# EasyEDA Pro project ProPrj_Dual_Motor_Driver_2026-05-02.epro, schematic Schematic1

## Sheets
1 Motor Driver IC: Board Name: Board1; Create Date: 2025-10-15; Page Name: Motor Driver IC; Project Name: Dual_Motor_Driver; Schematic Name: Schematic1; Update Date: 2025-10-17; Company: EasyEDA.com; Page Size: A4; Version: V1.0
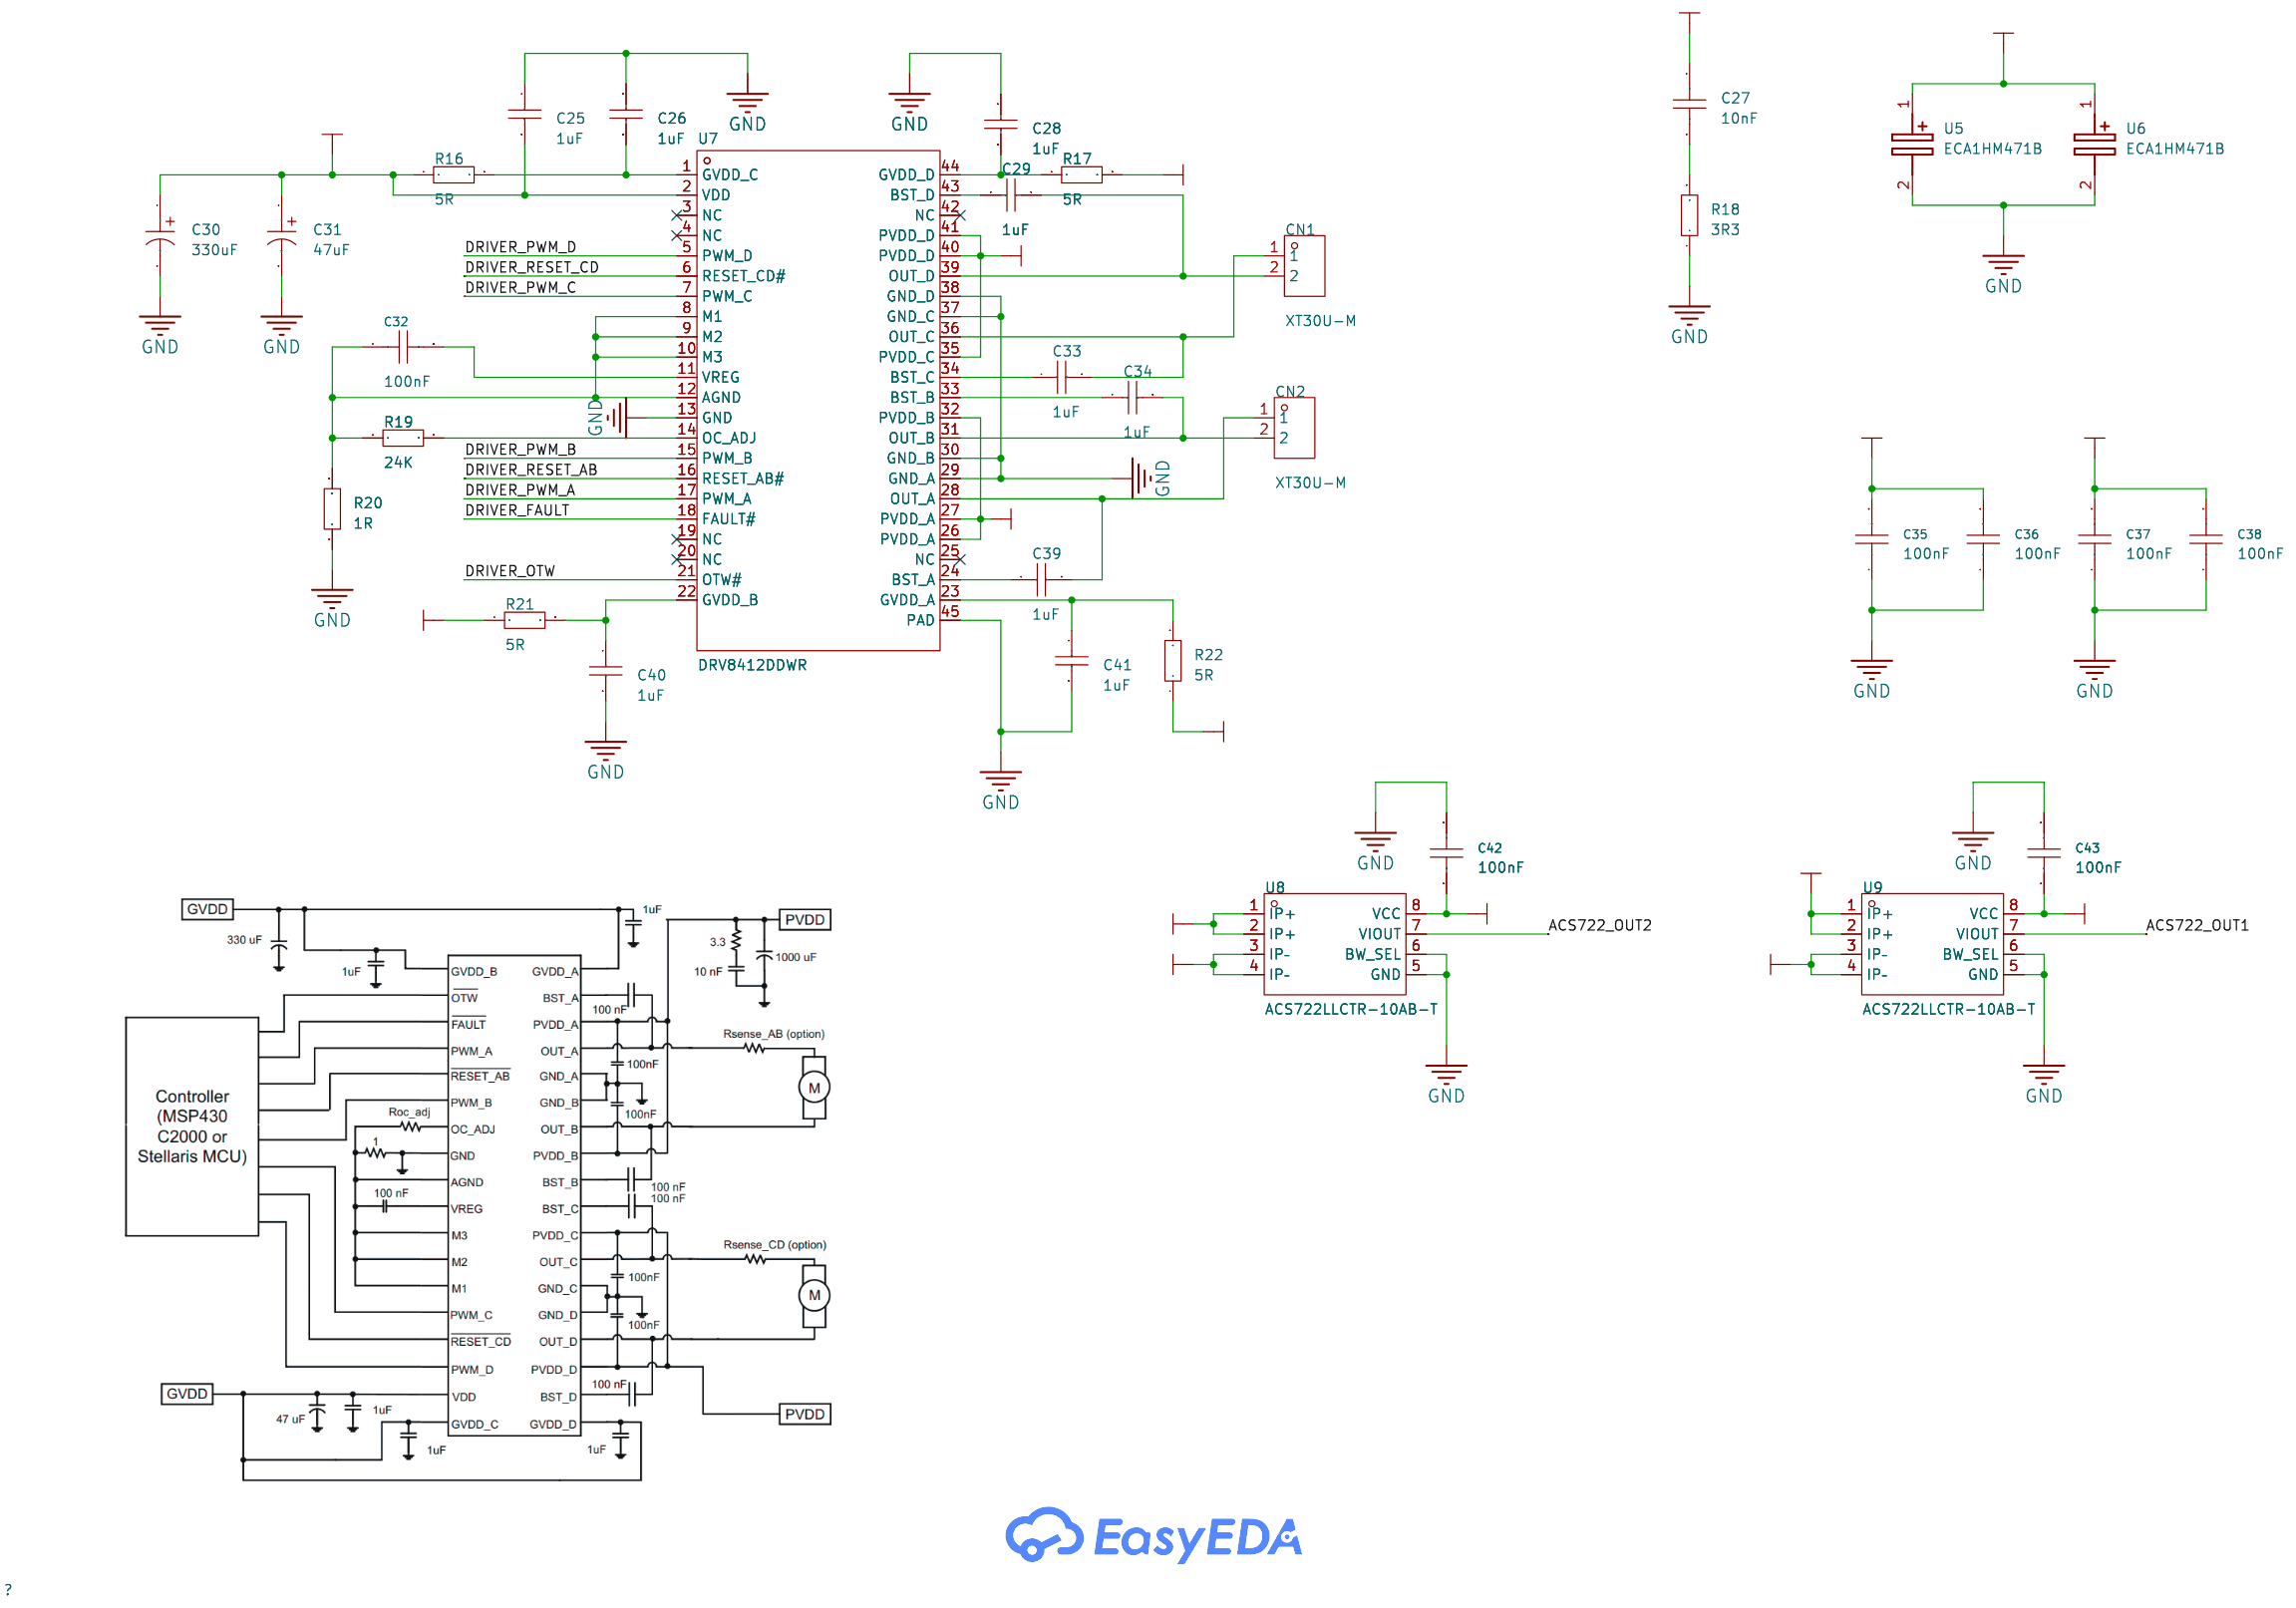
[diagram p0: Motor Driver IC]
2 Power Electroncis: Page Name: Power Electroncis; Update Date: 2025-10-18
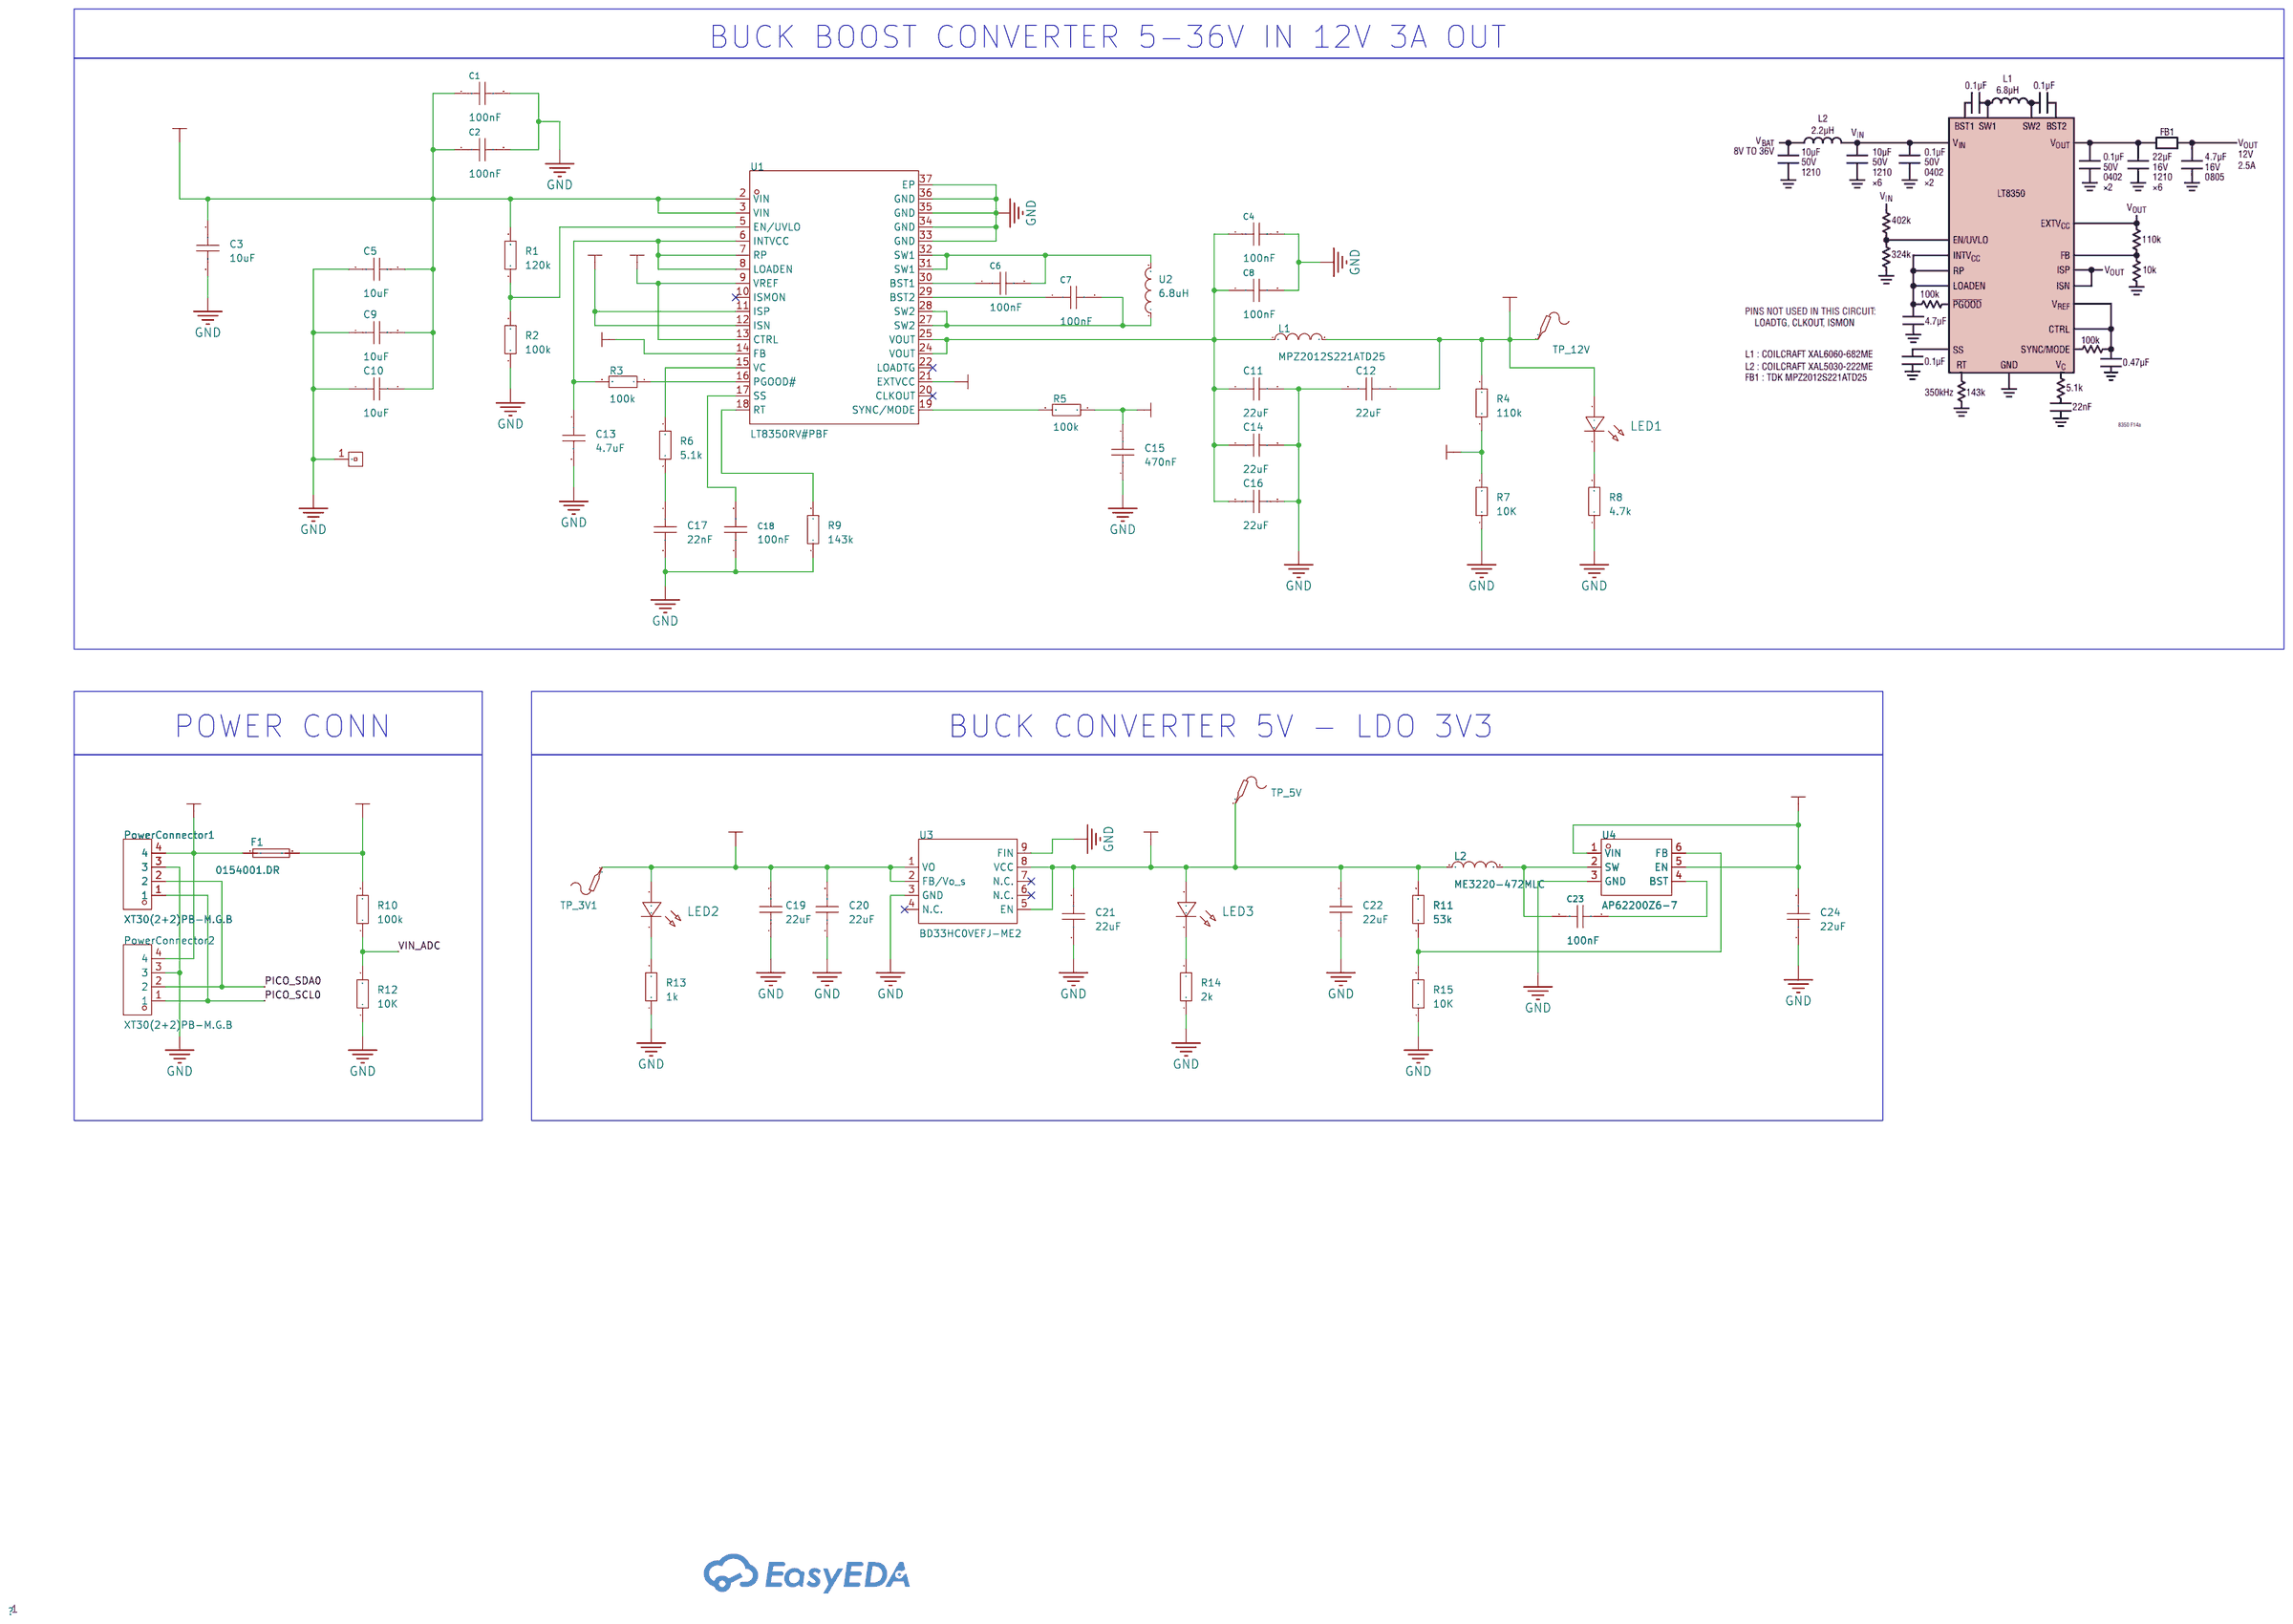
[diagram p1: Power Electroncis]
3 RP2350: Page Name: RP2350; Update Date: 2025-10-18
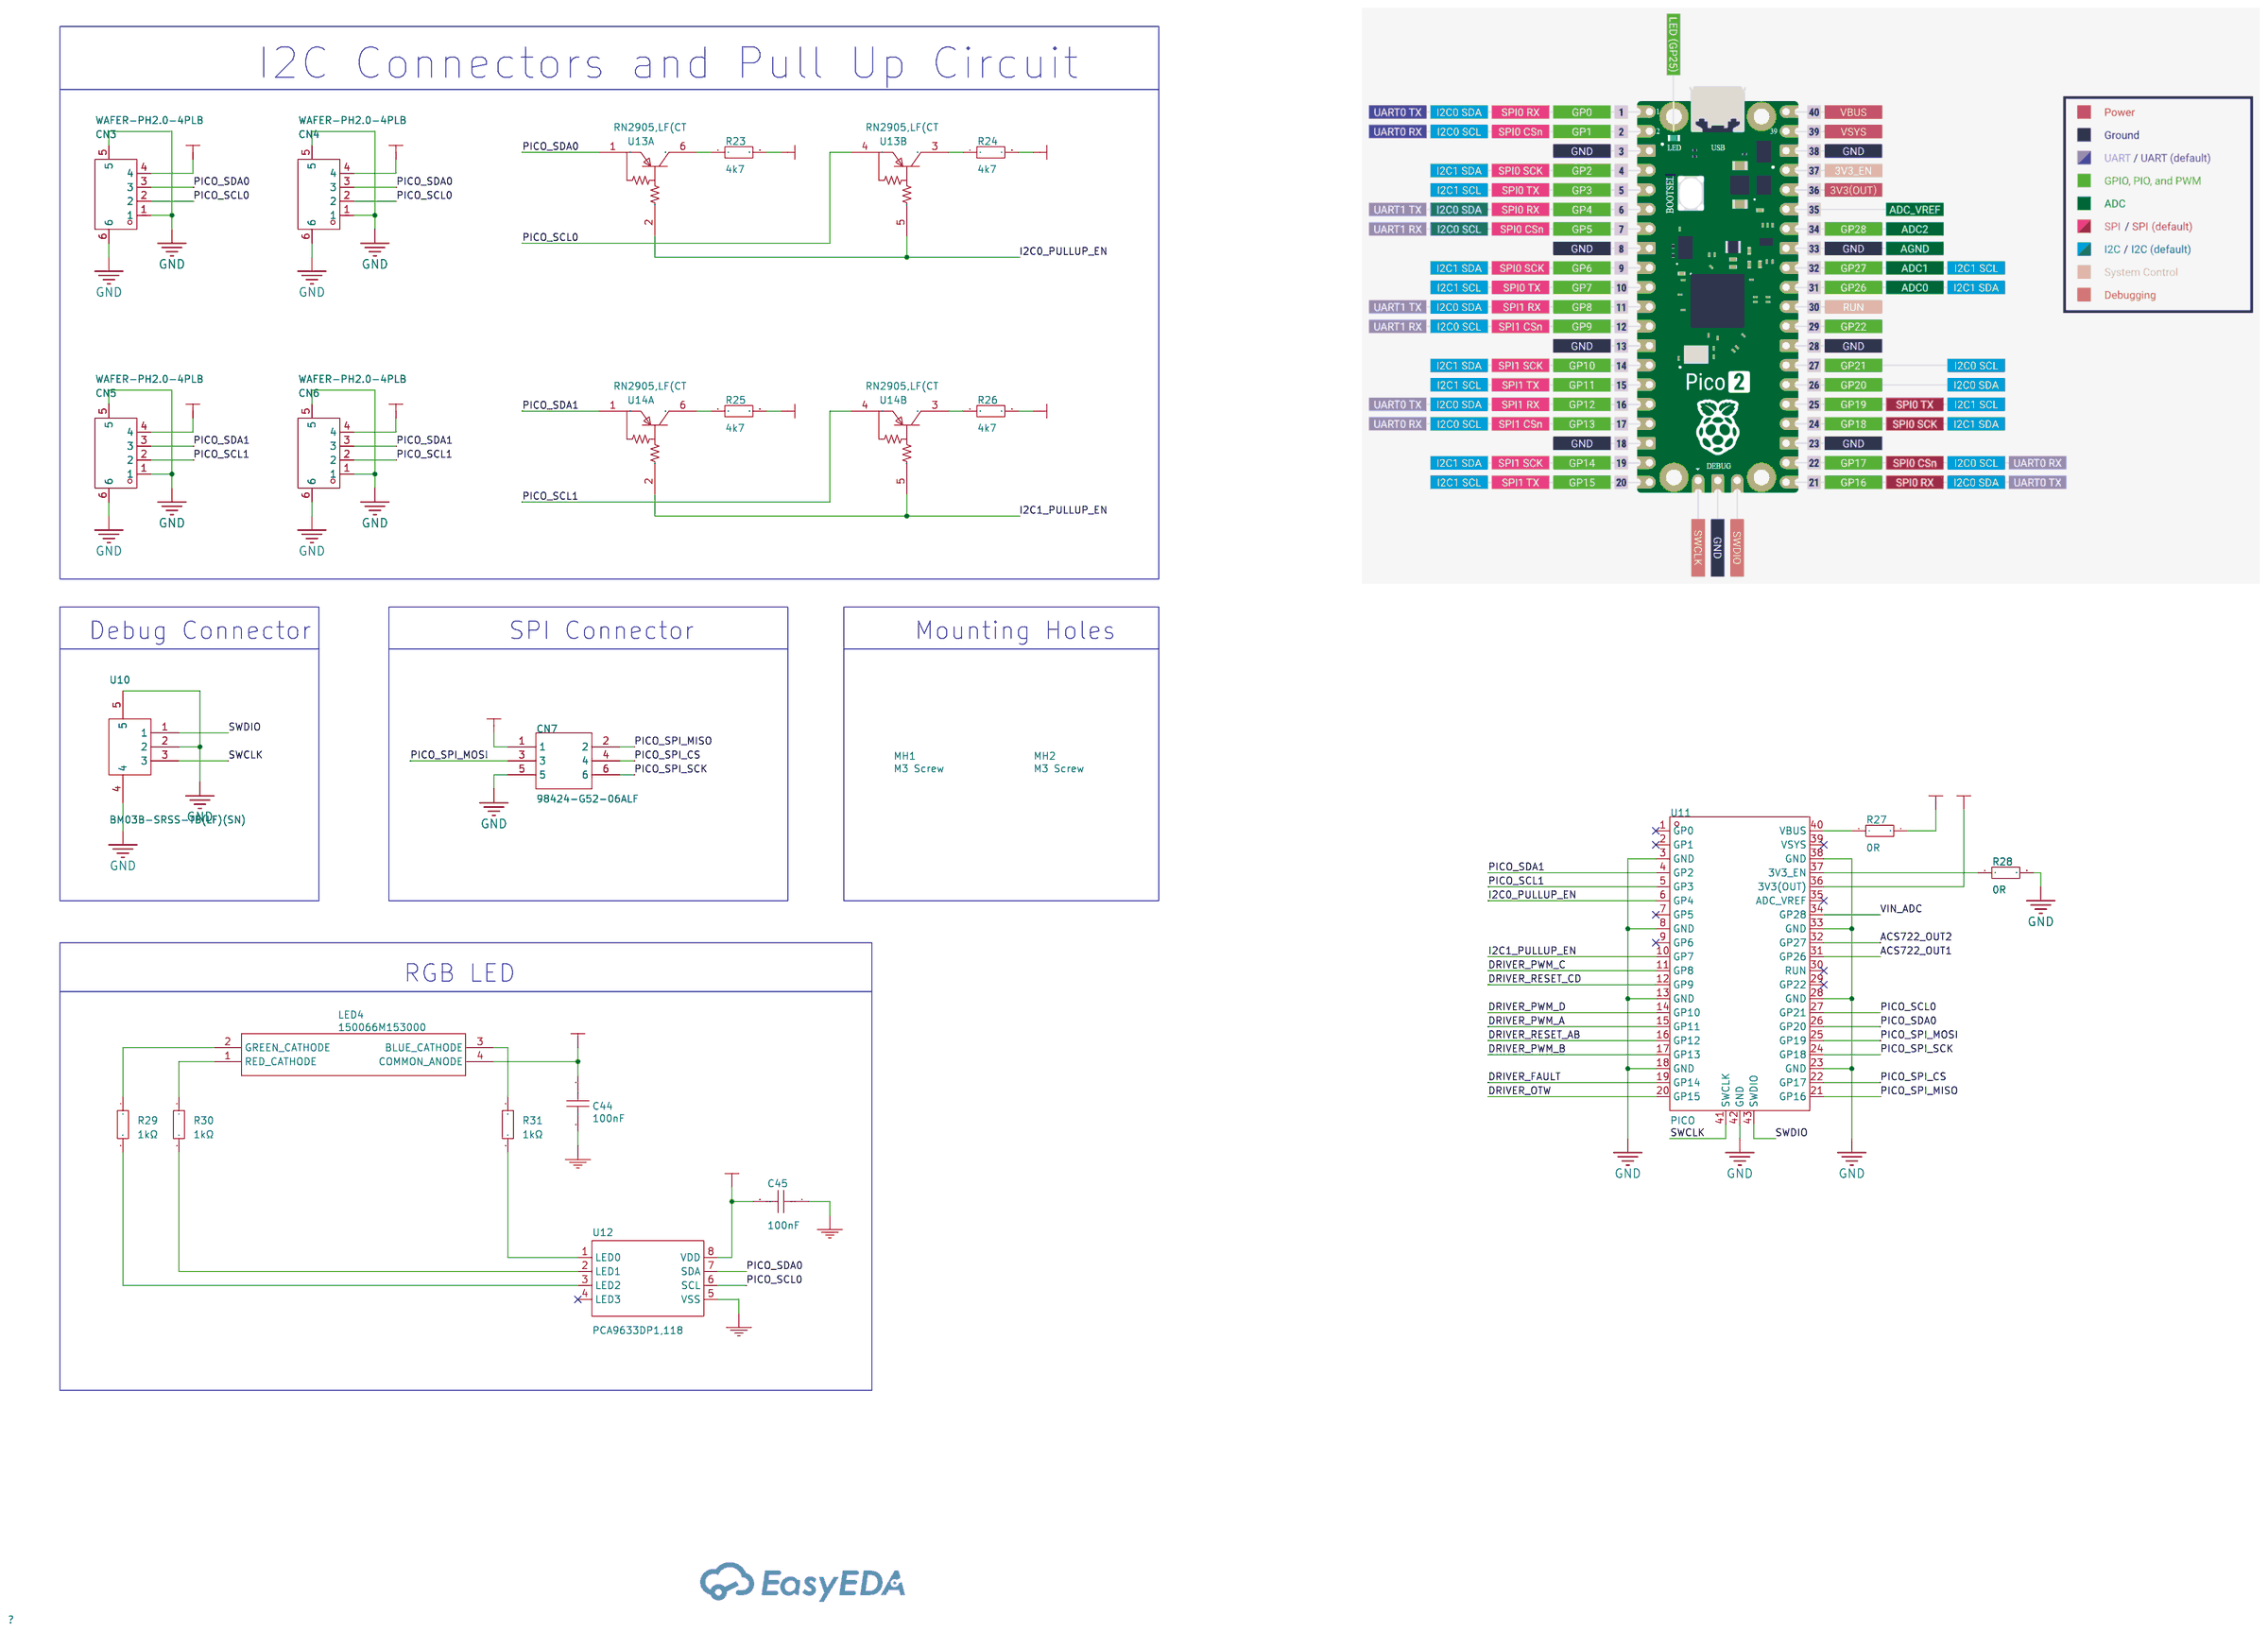
[diagram p2: RP2350]

## Parts
sheet Motor Driver IC
C25  1uF  [C0603]
C26  1uF  [C0603]
C27  10nF  [C0603]
C28  1uF  [C0603]
C29  1uF  [C0603]
C30  330uF  [CAP-SMD_BD8.0-L8.3-W8.3-FD]
C31  47uF  [CAP-SMD_BD6.3-L6.6-W6.6-LS7.8-FD]
C32  100nF  [C0603]
C33  1uF  [C0603]
C34  1uF  [C0603]
C35  100nF  [C0603]
C36  100nF  [C0603]
C37  100nF  [C0603]
C38  100nF  [C0603]
C39  1uF  [C0603]
C40  1uF  [C0603]
C41  1uF  [C0603]
C42  100nF  [C0603]
C43  100nF  [C0603]
CN1  XT30U-M  [CONN-TH_XT30U-M]
CN2  XT30U-M  [CONN-TH_XT30U-M]
R16  5R  [R0603]
R17  5R  [R0603]
R18  3R3  [R0603]
R19  24K  [R0603]
R20  1R  [R0603]
R21  5R  [R0603]
R22  5R  [R0603]
U5  ECA1HM471B  [CAPPRD500W65D1000H2200]
U6  ECA1HM471B  [CAPPRD500W65D1000H2200]
U7  DRV8412DDWR  [HTSSOP-44_L14.0-W6.1-P0.64-LS8.1-BL-EP]
U8  ACS722LLCTR-10AB-T  [SOIC-8_L4.9-W3.9-P1.27-LS6.0-BL]
U9  ACS722LLCTR-10AB-T  [SOIC-8_L4.9-W3.9-P1.27-LS6.0-BL]
sheet Power Electroncis
1PinHeader  -  [1PinHeader]
C1  100nF  [C0603]
C2  100nF  [C0603]
C3  10uF  [C0805]
C4  100nF  [C0603]
C5  10uF  [C0805]
C6  100nF  [C0603]
C7  100nF  [C0603]
C8  100nF  [C0603]
C9  10uF  [C0805]
C10  10uF  [C0805]
C11  22uF  [C0805]
C12  22uF  [C0805]
C13  4.7uF  [C0603]
C14  22uF  [C0805]
C15  470nF  [C0603]
C16  22uF  [C0805]
C17  22nF  [C0603]
C18  100nF  [C0603]
C19  22uF  [C0805]
C20  22uF  [C0805]
C21  22uF  [C0805]
C22  22uF  [C0805]
C23  100nF  [C0603]
C24  22uF  [C0805]
F1  0154001.DR  [FUSE-SMD_L9.8-W5.1]
L1  MPZ2012S221ATD25  [L0805]
L2  ME3220-472MLC  [IND-SMD_L3.2-W2.8]
LED1  -  [LED0603-R-RD]
LED2  -  [LED0603-R-RD]
LED3  -  [LED0603-R-RD]
PowerConnector1  XT30(2+2)PB-M.G.B  [CONN-TH_XT30PB-M]
PowerConnector2  XT30(2+2)PB-M.G.B  [CONN-TH_XT30PB-M]
R1  120k  [R0603]
R2  100k  [R0603]
R3  100k  [R0603]
R4  110k  [R0603]
R5  100k  [R0603]
R6  5.1k  [R0603]
R7  10K  [R0603]
R8  4.7k  [R0603]
R9  143k  [R0603]
R10  100k  [R0603]
R11  53k  [R0603]
R12  10K  [R0603]
R13  1k  [R0603]
R14  2k  [R0603]
R15  10K  [R0603]
TP_3V1  -  [Test-Point-0.5mm]
TP_5V  -  [Test-Point-0.5mm]
TP_12V  -  [Test-Point-0.5mm]
U1  LT8350RV#PBF  [LQFN-32_L6.0-W4.0-P0.50-BL-EP_LT8350RV]
U2  6.8uH  [IND-SMD_L6.6-W6.4]
U3  BD33HC0VEFJ-ME2  [HTSOP-J8_L4.9-W3.9-P1.27-LS6.0-BL-EP]
U4  AP62200Z6-7  [SOT-563_L1.6-W1.2-P0.50-LS1.6-BL]
sheet RP2350
C44  100nF  [C0603]
C45  100nF  [C0603]
CN3  WAFER-PH2.0-4PLB  [CONN-SMD_4P-P2.00_WAFER-200L-4A]
CN4  WAFER-PH2.0-4PLB  [CONN-SMD_4P-P2.00_WAFER-200L-4A]
CN5  WAFER-PH2.0-4PLB  [CONN-SMD_4P-P2.00_WAFER-200L-4A]
CN6  WAFER-PH2.0-4PLB  [CONN-SMD_4P-P2.00_WAFER-200L-4A]
CN7  98424-G52-06ALF  [CONN-SMD_98424-G52-06ALF]
LED4  150066M153000  [150066M153000]
MH1  M3 Screw  [MOUNTINGHOLE-M3]
MH2  M3 Screw  [MOUNTINGHOLE-M3]
R23  4k7  [R0603]
R24  4k7  [R0603]
R25  4k7  [R0603]
R26  4k7  [R0603]
R27  0R  [R0603]
R28  0R  [R0603]
R29  1kΩ  [R0603]
R30  1kΩ  [R0603]
R31  1kΩ  [R0603]
U10  BM03B-SRSS-TB(LF)(SN)  [CONN-SMD-3P-P1.00_BM03B-SRSS-TB-LF-SN]
U11  PICO  [COMM-SMD_L51.0-W21.0-P2.54_SC0916]
U12  PCA9633DP1,118  [TSSOP-8_L3.0-W3.0-P0.65-LS4.9-BL]
U13  RN2905,LF(CT  [SOT-323-6_L2.0-W1.3-P0.65-LS2.1-BR]  (sections 1,2)
U14  RN2905,LF(CT  [SOT-323-6_L2.0-W1.3-P0.65-LS2.1-BR]  (sections 1,2)

## Library data of the parts
C25 C26 C28 C29 C33 C34 C39-C41 = CL10A105KA8NNNC: Capacitance:1uF Tolerance:±10% Tolerance:±10% Voltage Rating:25V Temperature Coefficient:X5R; LCSC Part Name: 1uF ±10% 25V; Supplier Part: C5673; Manufacturer: SAMSUNG(三星); Supplier Footprint: 0603; JLCPCB Part Class: Extended Part; Datasheet: https://item.szlcsc.com/datasheet/CL10A105KA8NNNC/6132.html; Supplier: LCSC; Tolerance: ±10%; Voltage Rating: 25V; Temperature Coefficient: X5R
C13 C15 C17 C27 = CAP_0603: Supplier Footprint: 0603
C30 = EMK1EM331FB0D00R: Capacitance:330uF Tolerance:±20% Tolerance:±20% Voltage Rating:25V Diameter:8mm Height - Seated (Max):10.5mm Operating Temperature:-40℃~+105℃ Operating Temperature:-40℃~+105℃; LCSC Part Name: 330uF ±20% 25V; Supplier Part: C5289732; Manufacturer: AISHI(艾华集团); Supplier Footprint: SMD,D8xL10.5mm; JLCPCB Part Class: Extended Part; Datasheet: https://item.szlcsc.com/datasheet/EMK1EM331FB0D00R/6029048.html; Supplier: LCSC; Tolerance: ±20%; Voltage Rating: 25V; Diameter: 8mm; Height - Seated (Max): 10.5mm; Operating Temperature: -40℃~+105℃
C31 = EEV476M035S9GAA: Capacitance: Tolerance:±20% Tolerance:±20% Rated Voltage: Ripple Current:240mA@100kHz Equivalent Series Resistance(ESR):520mΩ@100kHz φD: L:5.65mm Lifetime @ Temp:2000hrs@105℃ Operating Temperature:-55℃~+105℃ Operating Temperature:-55℃~+105℃; LCSC Part Name: 47uF ±20% 35V; Supplier Part: C3829743; Manufacturer: KEMET(基美); Supplier Footprint: SMD,D6.3xL5.65mm; JLCPCB Part Class: Extended Part; Datasheet: https://atta.szlcsc.com/upload/public/pdf/source/20240116/210F461371644713945178D5B0331582.pdf; Supplier: LCSC; Tolerance: ±20%; Ripple Current: 240mA@100kHz; Equivalent Series Resistance(ESR): 520mΩ@100kHz; L: 5.65mm; Lifetime @ Temp: 2000hrs@105℃; Operating Temperature: -55℃~+105℃
C1 C2 C4 C6-C8 C18 C23 C32 C35-C38 C42 C43 = CL10B104KB8NNNC: Capacitance:100nF Tolerance:±10% Tolerance:±10% Voltage Rating:50V Temperature Coefficient:X7R; LCSC Part Name: 100nF ±10% 50V; Supplier Part: C1591; Manufacturer: SAMSUNG(三星); Supplier Footprint: 0603; JLCPCB Part Class: Extended Part; Datasheet: https://item.szlcsc.com/datasheet/CL10B104KB8NNNC/1943.html; Supplier: LCSC; Tolerance: ±10%; Voltage Rating: 50V; Temperature Coefficient: X7R
CN1 CN2 = XT30U-M: Brand:艾迈斯 Model:XT30U-M Power:- Output:- Input:- Size:- Interface:- Type:- Colour:Yellow MaximumCurrent:- Type:Plug RatedVoltage:- Type1:- NumberOfUSBHoles:- InterfaceType:公头 MetalMaterial:- InsulationMaterial:- RatedCurrent:- RecommendedWireGauge:- Flame; LCSC Part Name: AMASS(艾迈斯)轻量版锂电池插头公头 XT30U-M; Supplier Part: C99101; Manufacturer: AMASS(艾迈斯); JLCPCB Part Class: Extended Part; Datasheet: https://atta.szlcsc.com/upload/public/pdf/source/20170606/1496716542582.pdf; Supplier: LCSC; Brand: 艾迈斯; Type: Plug; Colour: Yellow; InterfaceType: 公头
R4 R6-R28 = Res_0603: Supplier Footprint: 0603
U5 U6 = ECA1HM471B
U7 = DRV8412DDWR: LCSC Part Name: 13.2V电机驱动芯片; Supplier Part: C79852; Manufacturer: TI(德州仪器); Supplier Footprint: HTSSOP-44-EP-6.1mm; JLCPCB Part Class: Extended Part; Datasheet: https://www.ti.com/cn/lit/gpn/drv8412; Supplier: LCSC
U8 U9 = ACS722LLCTR-10AB-T: Current Range:10A Current Range:10A Supply Voltage:3V~3.6V Supply Voltage:3V~3.6V Sensitivity:132mV/A Operating Temperature:-40℃~+150℃ Operating Temperature:-40℃~+150℃; LCSC Part Name: 电流霍尔芯片; Supplier Part: C459316; Manufacturer: ALLEGRO(美国埃戈罗); Supplier Footprint: SOIC-8; JLCPCB Part Class: Extended Part; Datasheet: https://atta.szlcsc.com/upload/public/pdf/source/20191122/C459318_E96328BA0B71E5A840AD4B22451AC723.pdf; Supplier: LCSC; Current Range: 10A; Supply Voltage: 3V~3.6V; Sensitivity: 132mV/A; Operating Temperature: -40℃~+150℃
1PinHeader = 1PinHeader
C3 C5 C9 C10 = CAP_0805: GRM21BR61H106KE43K; Supplier Footprint: 0805; Part Code: 3786004; Link: https://export.farnell.com/murata/grm21br61h106ke43k/cap-10uf-50v-mlcc-0805/dp/3786004
C11 C12 C14 C16 C19-C22 C24 = CL21A226MAYNNNE: Capacitance:22uF Tolerance:±20% Tolerance:±20% Voltage Rating:25V Temperature Coefficient:X5R; LCSC Part Name: 22uF ±20% 25V; Supplier Part: C602037; Manufacturer: SAMSUNG(三星); Supplier Footprint: 0805; JLCPCB Part Class: Extended Part; Datasheet: https://item.szlcsc.com/datasheet/CL21A226MAYNNNE/631473.html; Supplier: LCSC; Tolerance: ±20%; Voltage Rating: 25V; Temperature Coefficient: X5R
F1 = 0154001.DR: Type:SMD Fuse（with Holder） Current Rating:1A Voltage Rating  (AC):125V Voltage Rating (DC):125V Operating Temperature:-55℃~+125℃ Operating Temperature:-55℃~+125℃ Breaking Capacity:50A; LCSC Part Name: 125V贴片式保险丝（含保险丝座）; Supplier Part: C206908; Manufacturer: Littelfuse(美国力特); Supplier Footprint: SMD,9.7x5mm; JLCPCB Part Class: Extended Part; Datasheet: https://atta.szlcsc.com/upload/public/pdf/source/20181031/C315847_D8C8759CD5ED576C0EA975A2D5312378.pdf; Supplier: LCSC; Type: SMD Fuse（with Holder）; Current Rating: 1A; Voltage Rating  (AC): 125V; Voltage Rating (DC): 125V; Operating Temperature: -55℃~+125℃; Breaking Capacity: 50A
L1 = MPZ2012S221ATD25: Impedance @ Frequency:220Ω@100MHz Tolerance:±25% Tolerance:±25% DC Resistance(DCR):40mΩ Current Rating:3A Number of Circuits:1 Operating Temperature:-55℃~+125℃ Operating Temperature:-55℃~+125℃; LCSC Part Name: 单路 0805磁珠 阻抗220Ω@100MHz; Supplier Part: C307778; Manufacturer: TDK; Supplier Footprint: 0805; JLCPCB Part Class: Extended Part; Datasheet: https://item.szlcsc.com/datasheet/MPZ2012S221ATD25/291452.html; Supplier: LCSC; Impedance @ Frequency: 220Ω@100MHz; Tolerance: ±25%; DC Resistance(DCR): 40mΩ; Current Rating: 3A; Number of Circuits: 1; Operating Temperature: -55℃~+125℃
L2 = ME3220-332MLC: Supplier Part: C19276064; Manufacturer: Coilcraft(线艺); Supplier Footprint: SMD,3.2x2.8mm; JLCPCB Part Class: Extended Part; Datasheet: https://www.coilcraft.com/getmedia/228b5dd0-9801-44a2-a5bb-6dce2f1cc0a5/me3220.pdf; Supplier: LCSC
LED1-LED3 = LED_0603-R: Supplier Footprint: 0603
PowerConnector1 PowerConnector2 = XT30(2+2)PB-M.G.B: LCSC Part Name: XT30PB(2+2)功率数据混合插头公金黑PCB直插; Supplier Part: C19268029; Manufacturer: AMASS(艾迈斯); JLCPCB Part Class: Extended Part; Datasheet: https://atta.szlcsc.com/upload/public/pdf/source/20240112/EA39AAAE8FEC10464B997A9AF1F68E09.pdf; Supplier: LCSC
R1 = Res_0603: Supplier Footprint: 0603; Part Code: 2447313
R2 R3 R5 = Res_0603: MCMR06X1003FTL; Supplier Footprint: 0603; Part Code: 2073350
TP_3V1 TP_5V TP_12V = Test-Point: Test Point 测试点
U1 = LT8350RV#PBF_C5367366: Function:Buck-Boost Output Type:- Voltage - Supply:3V~40V Voltage - Supply:3V~40V Output Voltage:1V~18V Output Voltage:1V~18V Output Current:6A Frequency - Switching:200kHz~2MHz Frequency - Switching:200kHz~2MHz Operating Temperature:-40℃~+150℃ Operating; LCSC Part Name: 40V输入，18V输出，6A同步升降压静音开关; Supplier Part: C5367366; Manufacturer: ADI(亚德诺); Supplier Footprint: LQFN-32(4x6); JLCPCB Part Class: Extended Part; Datasheet: https://atta.szlcsc.com/upload/public/pdf/source/20230606/5BA8D890BC79223A591E2C0D7EEAA349.pdf; Supplier: LCSC; Function: Buck-Boost; Voltage - Supply: 3V~40V; Output Voltage: 1V~18V; Output Current: 6A; Frequency - Switching: 200kHz~2MHz; Operating Temperature: -40℃~+150℃; Synchronous Rectifier: Yes; Number of Outputs: 1; Topology: Buck-Boost; Quiescent Current: 650uA; Switch tube (built-in/external): Built-in
U2 = XAL6060-682MEC: Inductance:6.8uH Tolerance:±20% Tolerance:±20%; Supplier Part: C5355913; Manufacturer: Coilcraft(线艺); Supplier Footprint: SMD,6.4x6.1mm; JLCPCB Part Class: Extended Part; Datasheet: https://www.coilcraft.com/getmedia/ea51f14b-7f32-4dc6-8dfe-d4b70549040f/xal60xx.pdf; Supplier: LCSC; Tolerance: ±20%
U3 = BD33HC0VEFJ-ME2: Output Type:Adjustable Voltage - Supply:8V Output Voltage:1.5V~7V Output Voltage:1.5V~7V Output Current:1A Voltage Dropout:900mV@(1.0A) standby current:600uA Features:Over Current Protection；Enable；Over Temperature Protection Operating Temperature:-40℃~+1; Supplier Part: C22202420; Manufacturer: ROHM(罗姆); Supplier Footprint: HTSOP-J8; JLCPCB Part Class: Extended Part; Datasheet: https://item.szlcsc.com/datasheet/BD33HC0VEFJ-ME2/23634454.html; Supplier: LCSC; Output Type: Adjustable; Voltage - Supply: 8V; Output Voltage: 1.5V~7V; Output Current: 1A; Voltage Dropout: 900mV@(1.0A); standby current: 600uA; Features: Over Current Protection；Enable；Over Temperature Protection; Operating Temperature: -40℃~+105℃@(Ta)
U4 = AP62200Z6-7: Function:Buck Voltage - Supply:4.2V~18V Voltage - Supply:4.2V~18V Output Voltage:800mV~7V Output Voltage:800mV~7V Output Current:2A Frequency - Switching:750kHz Frequency - Switching:750kHz Operating Temperature:-40℃~+125℃ Operating Temperature:-40℃~+125℃; LCSC Part Name: 4.2V至18V输入，2A低静态电流同步降压转换器; Supplier Part: C2158024; Manufacturer: DIODES(美台); Supplier Footprint: SOT-563; JLCPCB Part Class: Extended Part; Datasheet: https://item.szlcsc.com/datasheet/AP62200Z6-7/2250074.html; Supplier: LCSC; Function: Buck; Voltage - Supply: 4.2V~18V; Output Voltage: 800mV~7V; Output Current: 2A; Frequency - Switching: 750kHz; Operating Temperature: -40℃~+125℃; Synchronous Rectifier: Yes; Number of Outputs: 1; Topology: Buck; Quiescent Current: 135uA; Switch tube (built-in/external): Built-In; Output Type: Adjustable
C44 C45 = 100nF: Supplier: LCSC; Manufacturer: Walsin(华新科); Manufacturer Part: 0603F104Z500CT; Supplier Part: C83060; JLCPCB Part Class: Extended Part; link: https://lcsc.com/eda_search?q=C83060&%26type=1&ref=editor
CN3-CN6 = WAFER-PH2.0-4PLB: Pins Structure:1x4P Pitch:2mm Mounting Type:Standing paste Reference Series:PH Number of Pins:4P Number of Rows:1 Number of PINs Per Row:4 Row Spacing:- Current Rating:2A Contact Material:Brass Contact Plating:- Operating Temperature:-25℃~+85℃ Operating T; LCSC Part Name: 1x4P 间距:2mm 立贴 系列:PH; Supplier Part: C3029433; Manufacturer: XUNPU(讯普); Supplier Footprint: SMD,P=2mm; JLCPCB Part Class: Extended Part; Datasheet: https://atta.szlcsc.com/upload/public/pdf/source/20220527/2DB47803B97F079508500AE9446D02AC.pdf; Supplier: LCSC; Pins Structure: 1x4P; Pitch: 2mm; Mounting Type: Standing paste; Reference Series: PH; Number of Pins: 4P; Number of Rows: 1; Number of PINs Per Row: 4; Current Rating: 2A; Contact Material: Brass; Operating Temperature: -25℃~+85℃; Voltage Rating: 250V; Plastic Material: LCP; Supplementary Features: Auxiliary soldering legs; Color: Beige; Z-Height of the Board: 6.2mm; X-Length of Bottom Edge on Board (Spacing Line): 12mm; Y-Width of Bottom Edge on Board: 7.5mm
CN7 = 98424-G52-06ALF: Pins Structure:2x3P Pitch:2mm Mounting Style:Standing paste Reference Series:- Number of Pins:6P Number of Rows:2 Number of PINs Per Row:3 Row Spacing:2mm Current Rating (Max):2A Contact Material:Copper alloy Contact Plating:Tin; LCSC Part Name: 间距:2mm 2x3P 立贴 奶油色; Supplier Part: C180222; Manufacturer: Amphenol; Supplier Footprint: SMD,P=2mm; JLCPCB Part Class: Extended Part; Datasheet: https://atta.szlcsc.com/upload/public/pdf/source/20180619/C239063_638E6A9043FDC72ACCFACA7EFFA9BB61.pdf; Supplier: LCSC; Pins Structure: 2x3P; Pitch: 2mm; Mounting Style: Standing paste; Number of Pins: 6P; Number of Rows: 2; Number of PINs Per Row: 3; Row Spacing: 2mm; Current Rating (Max): 2A; Contact Material: Copper alloy; Contact Plating: Tin
LED4 = 150066M153000
MH1 MH2 = M3 Screw
R29-R31 = RT0603BRD071KL: Type:Thin Film Resistor Resistance: Tolerance:±0.1% Tolerance:±0.1% Power(Watts): Overload Voltage (Max): Temperature Coefficient:±25ppm/℃ Temperature Coefficient:±25ppm/℃ Operating Temperature Range:-55℃~+155℃ Operating Temperature Range:-55℃~+155℃; LCSC Part Name: 薄膜电阻 1kΩ ±0.1% 100mW; Supplier Part: C110776; Manufacturer: YAGEO(国巨); Supplier Footprint: 0603; JLCPCB Part Class: Extended Part; Datasheet: https://atta.szlcsc.com/upload/public/pdf/source/20170704/1499151282044.pdf; Supplier: LCSC; Type: Thin Film Resistor; Tolerance: ±0.1%; Temperature Coefficient: ±25ppm/℃; Operating Temperature Range: -55℃~+155℃
U10 = BM03B-SRSS-TB(LF)(SN): Pins Structure:1x3P Pitch:1mm Mounting Type:Surface Mount,Vertical Reference Series:SH Number of Pins:3P Number of Rows:1 Number of PINs Per Row:3 Row Spacing:- Current Rating:1A Contact Material:Copper Alloy Contact Plating:Tin Operating Temperature:-25℃; LCSC Part Name: 1x3P 间距:1mm 立贴 系列:SH; Supplier Part: C160389; Manufacturer: JST; Supplier Footprint: SMD,P=1mm; Datasheet: https://item.szlcsc.com/datasheet/BM03B-SRSS-TB(LF)(SN)/171769.html; Supplier: LCSC; Pins Structure: 1x3P; Pitch: 1mm; Mounting Type: Surface Mount,Vertical; Reference Series: SH; Number of Pins: 3P; Number of Rows: 1; Number of PINs Per Row: 3; Current Rating: 1A; Contact Material: Copper Alloy; Contact Plating: Tin; Operating Temperature: -25℃~+85℃; Voltage Rating: 50V; Plastic Material: PA; Flame Retardant Rating: UL94V-0; Supplementary Features: Auxiliary Solder Pin; Color: White; Z-Height of the Board: 4.25mm; X-Length of Bottom Edge on Board (Spacing Line): 5mm; Y-Width of Bottom Edge on Board: 3.6mm
U11 = PICO: "基于Raspberry Pi RP2040芯片设计；处理器：双核Arm Cortex-M0+ @ 133MHz内存：264KB片上SRAM；2MB板上QSPI闪存接口：26个GPIO引脚，包括3个模拟输入；2 × UART；2 × SPI控制器；2 × I2C控制器；16个PWM通道；1 × USB 1.1控制器和PHY，支持主机和设备；8 × PIO状态机"; Supplier Part: C7203002; Manufacturer: Raspberry Pi(树莓派); JLCPCB Part Class: 扩展库; Supplier: LCSC
U12 = PCA9633DP1,118: Type:- Voltage - Input:2.3V~5.5V Voltage - Input:2.3V~5.5V Number of Channels:4 Output Voltage:5.5V Output Voltage:5.5V Output Current:25mA Dimming:PWM Operating temperature:-40℃~+85℃ Operating temperature:-40℃~+85℃; Supplier Part: C88381; Manufacturer: NXP(恩智浦); Supplier Footprint: TSSOP-8-3mm; JLCPCB Part Class: Extended Part; Datasheet: https://www.nxp.com.cn/docs/en/data-sheet/PCA9633.pdf; Supplier: LCSC; Voltage - Input: 2.3V~5.5V; Number of Channels: 4; Output Voltage: 5.5V; Output Current: 25mA; Dimming: PWM; Operating temperature: -40℃~+85℃
U13 U14 = RN2905,LF(CT: Transistor Type:2个PNP-预偏置 Collector-Emitter Breakdown Voltage (Vceo):50V Collector Current (Ic):100mA Power Dissipation (Pd):200mW Collector Cut-Off Current (Icbo):100nA DC Current Gain (hFE@Ic,Vce):80@10mA,5V Transition Frequency (fT):200MHz Collector-Em; LCSC Part Name: 电流:100mA 耐压:50V; Supplier Part: C5732699; Manufacturer: TOSHIBA(东芝); Supplier Footprint: TSSOP-6(SC-88)SOT-363; JLCPCB Part Class: Extended Part; Datasheet: https://atta.szlcsc.com/upload/public/pdf/source/231023/C17191517-11efee1d6b9a3e39efb7c9380ea4793e.pdf; Supplier: LCSC; Transistor Type: 2个PNP-预偏置; Collector-Emitter Breakdown Voltage (Vceo): 50V; Collector Current (Ic): 100mA; Power Dissipation (Pd): 200mW; Collector Cut-Off Current (Icbo): 100nA; DC Current Gain (hFE@Ic,Vce): 80@10mA,5V; Transition Frequency (fT): 200MHz; Collector-Emitter Saturation Voltage (VCE(sat)@Ic,Ib): 300mV@250uA,5mA

## Nets
3V3: C19.2 C20.2 C42.1 C43.1 C44.2 C45.2 CN3.4 CN4.4 CN5.4 CN6.4 CN7.1 LED2.1(A) LED4.4(COMMON_ANODE) R23.2 R24.2 R25.2 R26.2 TP_3V1.1 U3.1(VO) U3.2(FB/Vo_s) U8.8(VCC) U9.8(VCC) U11.36(3V3(OUT)) U12.8(VDD)
5V: C21.2 C22.2 L2.1 LED3.1(A) R11.2 R27.2 TP_5V.1 U3.5(EN) U3.8(VCC)
12V: C12.1 C24.2 C25.2 C30.1 C31.1 L1.2 LED1.1(A) R4.2 R16.1 R17.2 R21.1 R22.1 TP_12V.1 U1.11(ISP) U1.12(ISN) U1.21(EXTVCC) U4.1(VIN) U4.5(EN) U7.2(VDD)
GND: 1PinHeader.1 C1.2 C2.2 C3.2 C4.2 C5.1 C8.2 C9.1 C10.1 C11.2 C12.2 C13.2 C14.2 C15.2 C16.2 C17.2 C18.1 C19.1 C20.1 C21.1 C22.1 C24.1 C25.1 C26.1 C28.1 C30.2 C31.2 C35.1 C36.1 C37.1 C38.1 C40.2 C41.2 C42.2 C43.2 C44.1 C45.1 CN3.1 CN3.5 CN3.6 CN4.1 CN4.5 CN4.6 CN5.1 CN5.5 CN5.6 CN6.1 CN6.5 CN6.6 CN7.5 PowerConnector1.3 PowerConnector2.3 R2.1 R7.1 R8.1 R9.1 R12.1 R13.1 R14.1 R15.1 R18.1 R20.1 R28.2 U1.33(GND) U1.34(GND) U1.35(GND) U1.36(GND) U1.37(EP) U3.3(GND) U3.9(FIN) U4.3(GND) U5.2(-) U6.2(-) U7.13(GND) U7.29(GND_A) U7.30(GND_B) U7.37(GND_C) U7.38(GND_D) U7.45(PAD) U8.5(GND) U8.6(BW_SEL) U9.5(GND) U9.6(BW_SEL) U10.2 U10.4 U10.5 U11.3(GND) U11.8(GND) U11.13(GND) U11.18(GND) U11.23(GND) U11.28(GND) U11.33(GND) U11.38(GND) U11.42(GND) U12.5(VSS)
VIN_ADC: R10.1 R12.2 U11.34(GP28)
ACS722_OUT1: U9.7(VIOUT) U11.31(GP26)
ACS722_OUT2: U8.7(VIOUT) U11.32(GP27)
DRIVER_FAULT: U7.18(FAULT#) U11.19(GP14)
DRIVER_OTW: U7.21(OTW#) U11.20(GP15)
DRIVER_PWM_A: U7.17(PWM_A) U11.15(GP11)
DRIVER_PWM_B: U7.15(PWM_B) U11.17(GP13)
DRIVER_PWM_C: U7.7(PWM_C) U11.11(GP8)
DRIVER_PWM_D: U7.5(PWM_D) U11.14(GP10)
DRIVER_RESET_AB: U7.16(RESET_AB#) U11.16(GP12)
DRIVER_RESET_CD: U7.6(RESET_CD#) U11.12(GP9)
FB: R4.1 R7.2 U1.14(FB)
I2C0_PULLUP_EN: U11.6(GP4) U13.2(B) U13.5(B)
I2C1_PULLUP_EN: U11.10(GP7) U14.2(B) U14.5(B)
PICO_SCL0: CN3.2 CN4.2 PowerConnector1.1 PowerConnector2.1 U11.27(GP21) U12.6(SCL) U13.4(E)
PICO_SCL1: CN5.2 CN6.2 U11.5(GP3) U14.4(E)
PICO_SDA0: CN3.3 CN4.3 PowerConnector1.2 PowerConnector2.2 U11.26(GP20) U12.7(SDA) U13.1(E)
PICO_SDA1: CN5.3 CN6.3 U11.4(GP2) U14.1(E)
PICO_SPI_CS: CN7.4 U11.22(GP17)
PICO_SPI_MISO: CN7.2 U11.21(GP16)
PICO_SPI_MOSI: CN7.3 U11.25(GP19)
PICO_SPI_SCK: CN7.6 U11.24(GP18)
PWR: C1.1 C2.1 C3.1 C5.2 C9.2 C10.2 C27.1 F1.2 R1.2 R10.2 U1.2(VIN) U1.3(VIN) U5.1(+) U6.1(+) U8.3(IP–) U8.4(IP–) U9.1(IP+) U9.2(IP+)
PWR_AB: C35.2 C36.2 U7.26(PVDD_A) U7.27(PVDD_A) U7.32(PVDD_B) U8.1(IP+) U8.2(IP+)
PWR_CD: C37.2 C38.2 U7.35(PVDD_C) U7.40(PVDD_D) U7.41(PVDD_D) U9.3(IP–) U9.4(IP–)
PWR_CONN: F1.1 PowerConnector1.4 PowerConnector2.4
SWCLK: U10.3 U11.41(SWCLK)
SWDIO: U10.1 U11.43(SWDIO)
VREF: C15.1 R5.1 U1.9(VREF) U1.13(CTRL)
$1N1363: R19.2 U7.14(OC_ADJ)
$1N1372: C32.1 R19.1 R20.2 U7.8(M1) U7.9(M2) U7.10(M3) U7.12(AGND)
$1N1456: C32.2 U7.11(VREG)
$1N1664: C26.2 R16.2 U7.1(GVDD_C)
$1N1857: C40.1 R21.2 U7.22(GVDD_B)
$1N2033: C41.1 R22.2 U7.23(GVDD_A)
$1N2177: C28.2 R17.1 U7.44(GVDD_D)
$1N2316: C39.1 U7.24(BST_A)
$1N2493: C34.1 U7.33(BST_B)
$1N2538: C33.1 U7.34(BST_C)
$1N2583: C29.1 U7.43(BST_D)
$1N3603: C27.2 R18.2
$1N5435: C33.2 CN1.1 U7.36(OUT_C)
$1N5444: C29.2 CN1.2 U7.39(OUT_D)
$1N5477: C34.2 CN2.2 U7.31(OUT_B)
$1N5497: C39.2 CN2.1 U7.28(OUT_A)
$2N397: C6.2 U1.31(SW1) U1.32(SW1) U2.2
$2N415: C7.2 U1.27(SW2) U1.28(SW2) U2.1
$2N434: C13.1 R3.2 U1.6(INTVCC) U1.7(RP) U1.8(LOADEN)
$2N571: R1.1 R2.2 U1.5(EN/UVLO)
$2N1539: R3.1 U1.16(PGOOD#)
$2N1741: R5.2 U1.19(SYNC/MODE)
$2N2012: C17.1 R6.1
$2N2016: R6.2 U1.15(VC)
$2N2107: C18.2 U1.17(SS)
$2N2141: R9.2 U1.18(RT)
$2N2962: C6.1 U1.30(BST1)
$2N2981: C7.1 U1.29(BST2)
$2N4095: LED2.2(C) R13.2
$2N4199: LED1.2(C) R8.2
$2N4701: R11.1 R15.2 U4.6(FB)
$2N4706: C23.1 L2.2 U4.2(SW)
$2N4806: C23.2 U4.4(BST)
$2N5028: LED3.2(C) R14.2
$2N8816: C4.1 C8.1 C11.1 C14.1 C16.1 L1.1 U1.24(VOUT) U1.25(VOUT)
$3N51879: R23.1 U13.6(C)
$3N51883: R24.1 U13.3(C)
$3N52120: R25.1 U14.6(C)
$3N52122: R26.1 U14.3(C)
$3N56615: R27.1 U11.40(VBUS)
$3N56672: R28.1 U11.37(3V3_EN)
$3N57148: LED4.1(RED_CATHODE) R30.1
$3N57149: LED4.2(GREEN_CATHODE) R29.1
$3N57150: LED4.3(BLUE_CATHODE) R31.1
$3N57159: R30.2 U12.2(LED1)
$3N57160: R29.2 U12.3(LED2)
$3N57175: R31.2 U12.1(LED0)

Not connected (* = marked no-connect by the designer): U1 10(ISMON)* 20(CLKOUT)* 22(LOADTG)*; U3 4(N.C.)* 6(N.C.)* 7(N.C.)*; U7 3(NC)* 4(NC)* 19(NC)* 20(NC)* 25(NC)* 42(NC)*; U11 1(GP0)* 2(GP1)* 7(GP5)* 9(GP6)* 29(GP22)* 30(RUN)* 35(ADC_VREF)* 39(VSYS)*; U12 4(LED3)*

## Notes on the sheets
sheet 2
- BUCK BOOST CONVERTER 5-36V IN 12V 3A OUT
- POWER CONN
- BUCK CONVERTER 5V - LDO 3V3
sheet 3
- I2C Connectors and Pull Up Circuit
- Debug Connector
- SPI Connector
- Mounting Holes
- RGB LED
